# EAGLE design atx_form_card (EAGLE 6.6.0)
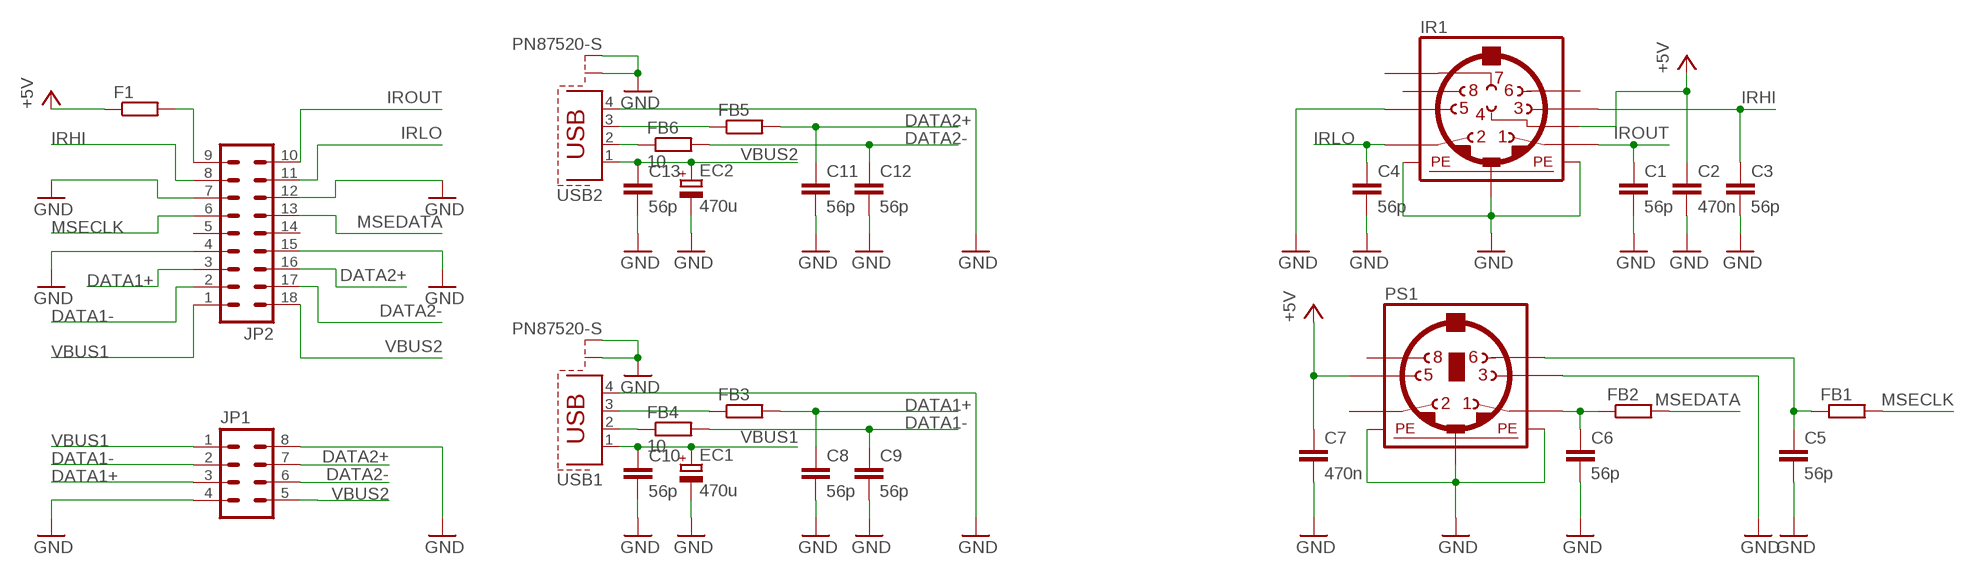
[diagram p0: schematic, sheet 1]

## Parts
C1  56p  C-EUC3216  [C3216]
C2  470n  C-EUC3216  [C3216]
C3  56p  C-EUC3216  [C3216]
C4  56p  C-EUC3216  [C3216]
C5  56p  C-EUC3216  [C3216]
C6  56p  C-EUC3216  [C3216]
C7  470n  C-EUC3216  [C3216]
C8  56p  C-EUC3216  [C3216]
C9  56p  C-EUC3216  [C3216]
C10  56p  C-EUC3216  [C3216]
C11  56p  C-EUC3216  [C3216]
C12  56p  C-EUC3216  [C3216]
C13  56p  C-EUC3216  [C3216]
EC1  470u  CPOL-EUE3.5-8  [E3,5-8]
EC2  470u  CPOL-EUE3.5-8  [E3,5-8]
F1  R-EU_0207/10  [0207/10]
FB1  R-EU_M3216  [M3216]
FB2  R-EU_M3216  [M3216]
FB3  R-EU_M3216  [M3216]
FB4  10  R-EU_M3216  [M3216]
FB5  R-EU_M3216  [M3216]
FB6  10  R-EU_M3216  [M3216]
IR1  MINI_DIN_8  [M_DIN8]
JP1  MA04-2  [MA04-2]
JP2  MA09-2  [MA09-2]
PS1  MINI_DIN_6  [M_DIN6]
USB1  PN87520-S  [PN87520-S]
USB2  PN87520-S  [PN87520-S]

## Nets
DATA1+: C8.1 FB3.2 JP1.3 JP2.3(3_)
DATA1-: C9.1 FB4.2 JP1.2 JP2.2(2_)
DATA2+: C11.1 FB5.2 JP1.7 JP2.16(12_)
DATA2-: C12.1 FB6.2 JP1.6 JP2.17(11_)
GND: C1.2 C2.2 C3.2 C4.2 C5.2 C6.2 C7.2 C8.2 C9.2 C10.2 C11.2 C12.2 C13.2 EC1.- EC2.- IR1.5 IR1.SH1(PE1) IR1.SH2(PE2) IR1.SH3(PE3) JP1.4 JP1.8 JP2.4(4_) JP2.7(7_) JP2.12(16_) JP2.15(13_) PS1.3 PS1.SH1(PE1) PS1.SH2(PE2) PS1.SH3(PE3) USB1.4 USB1.S1 USB1.S2 USB2.4 USB2.S1 USB2.S2
IRHI: C3.1 IR1.3 JP2.8(8_)
IRLO: C4.1 IR1.2 JP2.11(17_)
IROUT: C1.1 IR1.1 JP2.10(18_)
MSECLK: FB1.2 JP2.6(6_)
MSEDATA: FB2.2 JP2.13(15_)
N$1: FB4.1 USB1.2
N$2: C6.1 FB2.1 PS1.1
N$3: FB6.1 USB2.2
N$4: FB3.1 USB1.3
N$5: FB5.1 USB2.3
N$6: C5.1 FB1.1 PS1.6
N$8: F1.2 JP2.9(9_)
VBUS1: C10.1 EC1.+ JP1.1 JP2.1(1_) USB1.1
VBUS2: C13.1 EC2.+ JP1.5 JP2.18(10_) USB2.1
VCC: C2.1 C7.1 F1.1 IR1.4 PS1.5 ; supply symbol labelled +5V
Unconnected: IR1.6 IR1.7 IR1.8 JP2.5(5_) JP2.14(14_) PS1.2 PS1.8

## Library data of the parts
C1-C13 = resistor-custom:C-EU: CAPACITOR, European symbol
EC1 EC2 = resistor-custom:CPOL-EU: POLARIZED CAPACITOR, European symbol
F1 FB1-FB6 = resistor-custom:R-EU_: RESISTOR, European symbol
IR1 = mini_din:MINI_DIN_8
JP1 = con-lstb-custom:MA04-2: PIN HEADER; OC_FARNELL: unknown; OC_NEWARK: unknown
JP2 = con-lstb-custom:MA09-2: PIN HEADER; OC_FARNELL: unknown; OC_NEWARK: unknown
PS1 = mini_din:MINI_DIN_6
USB1 USB2 = con-berg-custom:PN87520-S; OC_FARNELL: unknown; OC_NEWARK: unknown

## Board
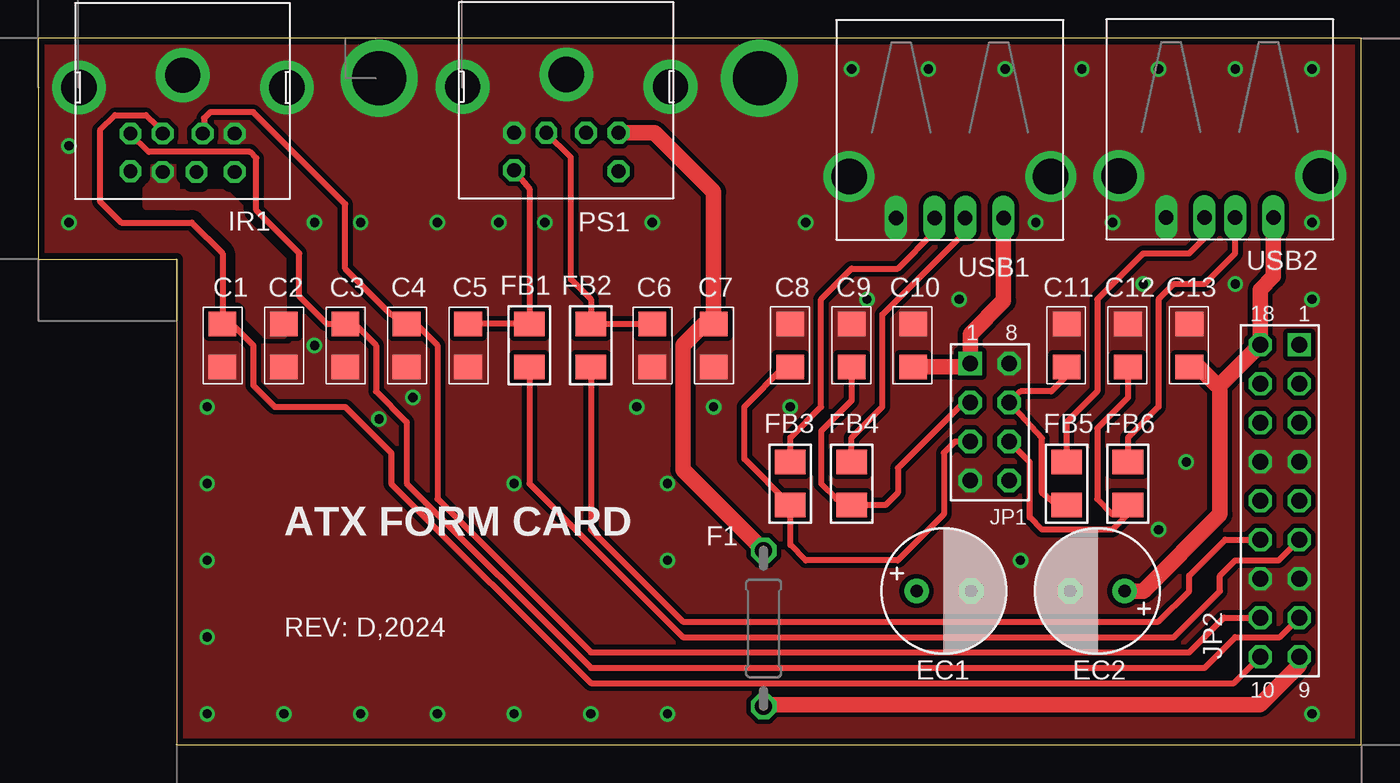
[diagram p1: board, top side]
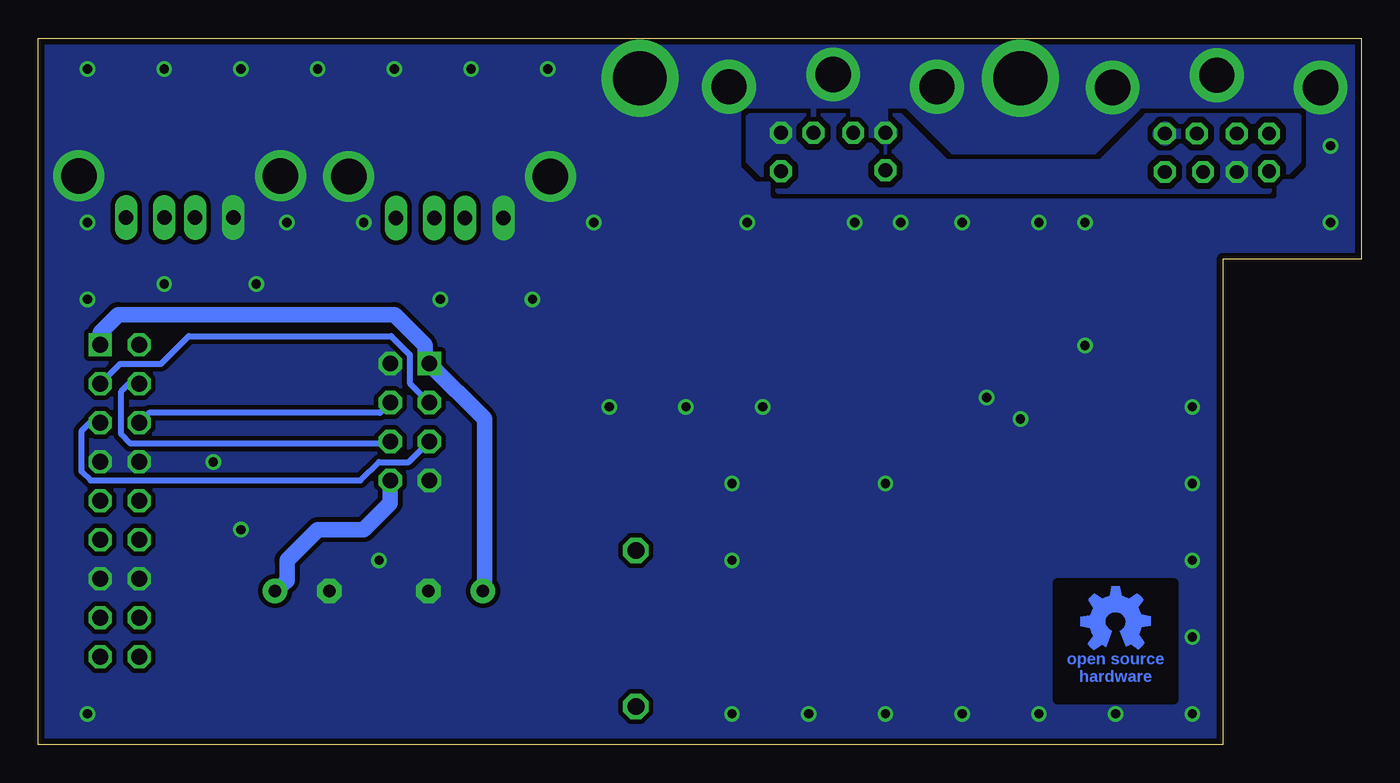
[diagram p2: board, bottom side, seen from below]

Size 86.2 x 46 mm. Coordinates in mm from the lower left corner, seen from the top.
Outline: 0,46 0,31.6 9,31.6 9,0 86.2,0 86.2,46 0,46
Copper layers (1*16): Top 0.035mm / dielectric 1.5mm / Bottom 0.035mm
Design rules "default *": minimum track width 6mil, minimum drill 0.5mm, track to track 6mil, track to pad 6mil, pad to pad 6mil, via to via 6mil, smd to smd 6mil, copper to edge 0.4mm, drill to drill 0.5mm, minimum pad ring 10mil, minimum via ring 8mil, stop-mask expansion 4mil, vias tented up to drill 0.6mm, thermal gap 10mil

### Footprints (pad centres in the part's own frame; a part is rotated, then mirrored left to right if it is on the bottom)
C3216 = smd 1.6 x 1.8: 1 -1.4,0; 2 1.4,0
E3,5-8 = drill 0.813 pad 1.6: + -1.778,0 | drill 0.813 pad 1.6 octagon: - 1.778,0
0207/10 = drill 1.1 octagon: 1 -5.08,0; 2 5.08,0
M3216 = smd 1.6 x 2: 1 -1.4,0; 2 1.4,0
M_DIN8 = drill 0.9 pad 1.422 octagon: 1 -1.3,-3.8; 2 1.3,-3.8; 3 -3.4,-3.8; 4 -1.3,-6.3; 5 3.4,-3.8; 6 -3.4,-6.25; 7 0.9,-6.3; 8 3.4,-6.3 | drill 2.3 pad 3.5: SH1 6.8,-0.8; SH2 0,0; SH3 -6.75,-0.8
MA04-2 = drill 1.016 square: 1 -1.27,3.81 | drill 1.016 octagon: 2 -1.27,1.27; 3 -1.27,-1.27; 4 -1.27,-3.81; 5 1.27,-3.81; 6 1.27,-1.27; 7 1.27,1.27; 8 1.27,3.81
MA09-2 = drill 1.016 square: 1 1.27,10.16 | drill 1.016 octagon: 2 1.27,7.62; 3 1.27,5.08; 4 1.27,2.54; 5 1.27,0; 6 1.27,-2.54; 7 1.27,-5.08; 8 1.27,-7.62; 9 1.27,-10.16; 10 -1.27,-10.16; 11 -1.27,-7.62; 12 -1.27,-5.08; 13 -1.27,-2.54; 14 -1.27,0; 15 -1.27,2.54; 16 -1.27,5.08; 17 -1.27,7.62; 18 -1.27,10.16
M_DIN6 = drill 0.9 pad 1.422 octagon: 1 -1.3,-3.75; 2 1.3,-3.75; 3 -3.4,-3.75; 5 3.4,-3.75; 6 -3.4,-6.2; 8 3.4,-6.25 | drill 2.3 pad 3.5: SH1 6.8,-0.75; SH2 0,0.05; SH3 -6.75,-0.75
PN87520-S = drill 0.95 long: 1 -3.5,2.71; 2 -1,2.71; 3 1,2.71; 4 3.5,2.71 | drill 2.3 pad 2.9: S1 -6.57,0; S2 6.57,0

### Placement (x,y rotation side)
C1  12,26 270 top
C2  16,26 270 top
C3  20,26 270 top
C4  24,26 270 top
C5  28,26 270 top
C6  40,26 270 top
C7  44,26 270 top
C8  49,26 90 top
C9  53,26 90 top
C10  57,26 90 top
C11  67,26 90 top
C12  71,26 90 top
C13  75,26 90 top
EC1  59,10 0 top
EC2  69,10 180 top
F1  47.26,7.56 270 top
FB1  32,26 270 top
FB2  36,26 270 top
FB3  49,17 270 top
FB4  53,17 270 top
FB5  67,17 270 top
FB6  71,17 270 top
IR1  9.4,43.6 0 top
JP1  62,21 0 top
JP2  80.9,15.88 0 top
PS1  34.4,43.6 0 top
U$2  [OSHW_5MM]  16,8 0 bottom
USB1  59.4,37 180 top
USB2  76.99,37.04 180 top

### Tracks (layer width: path | path; a pad name or v marks a point on that pad's centre or on a via)
DATA1+
  Top 0.406: 48.6,24.6 46,22 46,18.6 FB3.2 49,13 50,12 56,12 59,15 59,19 59.73,19.73 JP1.3
  Top 0.61: 48.6,24.6 C8.1
  Bottom 0.406: JP2.3 82.84,20.96 83.4,20.4 83.4,17.8 82.8,17.2 65.2,17.2 64,18.4 62.06,18.4 JP1.3
DATA1-
  Top 0.406: C9.1 53,22.4 51,20.4 51,17 52,16 52.6,16 FB4.2 55.2,15.6 56,16.4 56,18 60.27,22.27 JP1.2
  Bottom 0.406: JP2.2 80.87,24.8 78.2,24.8 76.4,26.6 63.2,26.6 62,25.4 62,23.54 JP1.2
DATA2+
  Top 0.406: 67.4,15.6 66.4,15.6 65.4,16.4 65.4,19.94 JP1.7 64,23 66,23 67,24 C11.1
  Top 0.61: FB5.2 67.4,15.6
  Bottom 0.406: JP2.16 78.99,21.6 63.94,21.6 JP1.7
DATA2-
  Top 0.406: 71.6,15.6 70,14 65.4,14 64.6,14.8 64.6,18.4 JP1.6 | C12.1 71,22.6 69,20.6 69,16 70,15 70.6,15 FB6.2
  Top 0.61: FB6.2 71.6,15.6
  Bottom 0.406: JP1.6 63.4,19.6 80.2,19.6 80.8,20.2 80.8,23 80.3,23.5 JP2.17
GND  (via drill 0.6, 3.5 pad 5)
  other vias: 11,2 16,2 21,2 26,2 31,2 36,2 41,2 11,7 11,12 11,17 11,22 31,17 41,12 41,17 18,26 22.2,21.2 24.4,22.6 2,34 2,39 18,34 21,34 26,34 30,34 33,34 40,34 50,34 65,34 70,34 83,34 83,2 64,12 44,22 39,22 49,22 54,29 60,29 83,29 78,30 74.8,18.4 73,14 72,30 83,44 78,44 73,44 68,44 63,44 58,44 53,44 22.2,43.4 47,43.4
  pour Bottom (isolate 0.305, rank 6, no thermals): 86.2,46 86.2,0 9,0 9,31.6 0,31.6 0,46
  pour Top (isolate 0.305, rank 6, no thermals): 86.2,46 86.2,0 9,0 9,31.6 0,31.6 0,46
IRHI
  Top 0.406: JP2.8 80.91,7 78,7 76,5 36,5 24,17 24,21 22,23 22,26 20.6,27.4 C3.1 18.8,27.4 17,29.2 17,32 14.2,34.8 14.2,38.2 13.8,38.6 7.2,38.6 IR1.3
IRLO
  Top 0.406: JP2.11 77.26,8.26 75,6 36,6 26,16 26,26 24.6,27.4 C4.1 23,28 20,31 20,35.2 14,41.2 11.2,41.2 10.8,40.8 10.8,39.9 IR1.2
IROUT
  Top 0.406: IR1.1 7.7,40.3 7,41 5,41 4,40 4,35.4 5.4,34 10,34 12,32 C1.1 12.6,27.4 14,26 14,23.4 15.4,22 20,22 23,19 23,17 36,4 77.91,4 JP2.10
MSECLK
  Top 0.406: FB1.2 32,17 42,7 74,7 77,10 77,11 78,12 80.83,12 JP2.6
MSEDATA
  Top 0.406: FB2.2 36,14 42,8 73,8 75,10 75,11 77.34,13.34 JP2.13
N$1
  Top 0.406: FB4.1 53,20 55,22 55,28 60.4,33.4 USB1.2
N$2
  Top 0.406: C6.1 FB2.1 36,29 34.7,30.3 34.7,38.25 PS1.1
N$3
  Top 0.406: FB6.1 71,20 73,22 73,29 74,30 76,30 77.99,31.99 USB2.2
N$4
  Top 0.406: FB3.1 49,20 51,22 51,29 53,31 56,31 58.4,33.4 USB1.3
N$5
  Top 0.406: FB5.1 67,21 69,23 69,29 72,32 75,32 75.99,32.99 USB2.3
N$6
  Top 0.406: PS1.6 32,36.2 FB1.1 C5.1
N$8
  Top 1.016: JP2.9 82.17,5.17 79.6,2.6 47.54,2.6 F1.2
VBUS1
  Top 0.61: 60.52,24.6 JP1.1
  Top 1.016: C10.1 60.52,24.6 | JP1.1 60.73,26.73 62.9,28.9 USB1.1
  Bottom 1.016: JP2.1 82.17,26.83 81,28 63,28 61,26 61,25.08 JP1.1 57.13,21.21 57.13,10 | EC1.+ 57.13,10 | 57,10 57.13,10
VBUS2
  Top 1.016: EC2.+ 72,10 77,15 77,23.41 | 77,23.41 JP2.18 79.63,29.63 80.49,30.49 USB2.1 | 77,23.41 76.79,23.41 75.4,24.8 75.2,24.8 C13.1
  Bottom 1.016: JP1.5 63.27,15.73 65,14 68,14 70,12 70,10.67 EC2.+
VCC
  Top 0.61: C7.1 43.4,27.4
  Top 1.016: C7.1 44,36 40.15,39.85 PS1.5 | 43.4,27.4 42,26 42,17.9 F1.1
  pour Bottom (isolate 0.406, rank 4, no thermals): 40,41 40,38 38,36 6,36 4,38 4,41 14,41 17,38 27,38 30,41
  pour Top (isolate 0.61, no thermals): 13.2,35 16,32 16,26.6 14.4,26.6 12,30.4 12,32 9,35 7,35 7,38 9,38 9,36 12.2,36

### Text on the board
tNames: ATX FORM CARD | REV: D,2024